# Altium schematic sheet 7_Solenoid.SchDoc
size A
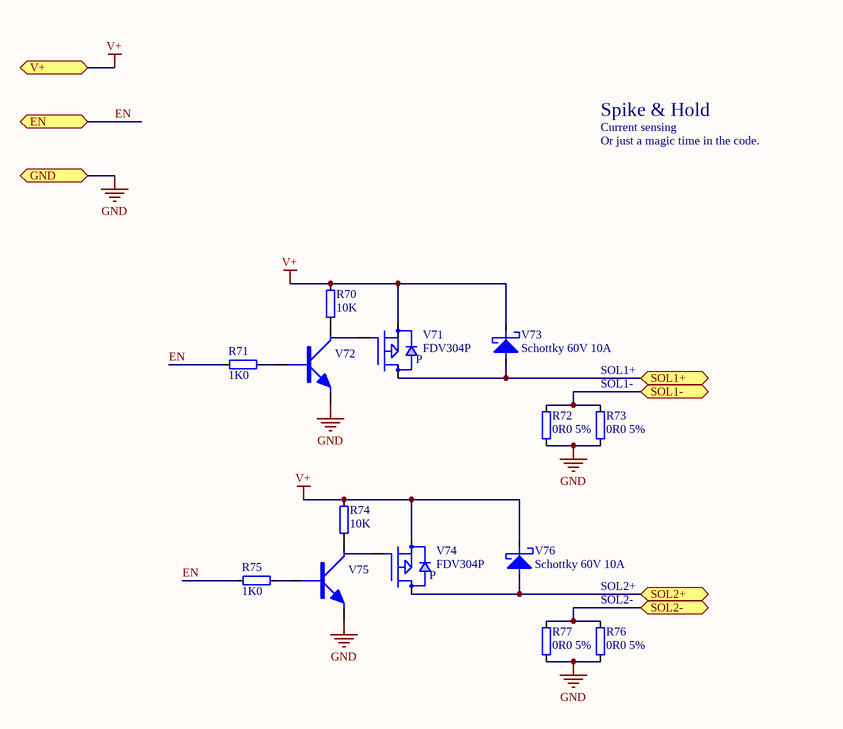
[diagram p0: 7_Solenoid.SchDoc]

## Parts
R70  10K  [1206]
R71  1K0  [0805]
R72  0R0 5%  [1206]
R73  0R0 5%  [1206]
R74  10K  [1206]
R75  1K0  [0805]
R76  0R0 5%  [1206]
R77  0R0 5%  [1206]
V71  FDV304P  [SOT23]
V72  BC846B  [SOT23]  (value not drawn)
V73  Schottky 60V 10A  [DO-214AB-DIODE]
V74  FDV304P  [SOT23]
V75  BC846B  [SOT23]  (value not drawn)
V76  Schottky 60V 10A  [DO-214AB-DIODE]

## Ports
EN, GND, SOL1+, SOL1-, SOL2+, SOL2-, V+

## Nets
GND: R72.1 R73.1 R76.1 R77.1 V72.y(Emitter) V75.y(Emitter) ; port GND
V+: R70.2 R74.2 V71.y(s) V73.k V74.y(s) V76.k ; port V+
EN: R71.1 R75.1 ; port EN
SOL1+: V71.x(d) V73.a ; port SOL1+
SOL1-: R72.2 R73.2 ; port SOL1-
SOL2+: V74.x(d) V76.a ; port SOL2+
SOL2-: R76.2 R77.2 ; port SOL2-
NetR70_1: R70.1 V72.x(Collector)
NetR71_2: R71.2 V72.z(Base)
NetR74_1: R74.1 V75.x(Collector)
NetR75_2: R75.2 V75.z(Base)

Not connected (* = marked no-connect by the designer): V71 z(gate); V74 z(gate)

## Notes on the sheet
- Spike & Hold
- Current sensing
- Or just a magic time in the code.
- (near R73) SOL1+
- (near R73) SOL1-
- (near R76) SOL2+
- (near R76) SOL2-
- (in symbol 5221) P

## Library data of the parts
R70 R74 = 3867: Resistor; Part Field 1: RES 10K 1% 250mW 1206 RoHS; Manufacturer: Phycomp; PartNumber: RC1206FR-0710KL; IPN: 3867; EndOfLife: Active EOL:Jan 2031; Characteristics: 100ppm/C -55..+155C U=150Vrms Reel=5000pcs; OrderNumber: 232272461003L; Lead_Process_Compatible: Yes; SubmittedBy: ART; DeviceRank: 2; Part Field 2: Phycomp RC1206FR-0710KL; ComponentLink1Description: Phycomp_RC1206series_DS.pdf; ComponentLink2Description: Phycomp_Generic_RCS.pdf; ComponentLink1URL: http://ecad.vsl.com.au/apps/BomGen/Data/rel/datasheets/new_parts/Phycomp_RC1206series_DS.pdf; ComponentLink2URL: http://ecad.vsl.com.au/apps/BomGen/Data/rel/rohs_compliance/new_certificates/Phycomp_Generic_RCS.pdf; Altium_Comment_Old: RES 10K 1% 250mW 1206 RoHS; Altium_Comment: 10K; Symbol: RES; Supplier1: Arrow; Supplier1_PartNumber: RC1206FR-0710KL; Supplier2: Xon; IPN_Search: 3867; PartType: PCB; CheckedBy: ART; Price_5000: M$0.004
R71 R75 = 3674: Resistor; Part Field 1: RES 1K0 1% 125mW 0805 RoHS; Manufacturer: Phycomp; PartNumber: RC0805FR-071KL; IPN: 3674; EndOfLife: Active EOL:Jan 2023; Characteristics: 100ppm/C -55..+155C U=150Vrms Reel=5000pcs; OrderNumber: 232273461002L; Lead_Process_Compatible: Yes; SubmittedBy: ART; DeviceRank: 2; Part Field 2: Phycomp RC0805FR-071KL; ComponentLink1Description: Phycomp_RC0805series_DS.pdf; ComponentLink2Description: Phycomp_Generic_RCS.pdf; ComponentLink1URL: http://ecad.vsl.com.au/apps/BomGen/Data/rel/datasheets/new_parts/Phycomp_RC0805series_DS.pdf; ComponentLink2URL: http://ecad.vsl.com.au/apps/BomGen/Data/rel/rohs_compliance/new_certificates/Phycomp_Generic_RCS.pdf; Altium_Comment_Old: RES 1K0 1% 125mW 0805 RoHS; Altium_Comment: 1K0; Symbol: RES; Supplier1: Arrow; Supplier1_PartNumber: RC0805FR-071KL; Supplier2: Xon; IPN_Search: 3674; PartType: PCB; CheckedBy: ART; Price_5000: M$0.003
R72 R73 R76 R77 = 3393: Resistor; Part Field 1: RES 0R0 5% 250mW LINK 1206 RoHS; Manufacturer: Phycomp; PartNumber: RC1206JR-070RL; IPN: 3393; EndOfLife: Active EOL:Jan 2031; Characteristics: 100ppm/C -55..+155C 2A 150Vrms Reel=5000pcs; OrderNumber: 232271191032L; Lead_Process_Compatible: Yes; SubmittedBy: ART; DeviceRank: 2; Part Field 2: Phycomp RC1206JR-070RL; ComponentLink1Description: Phycomp_RC1206series_DS.pdf; ComponentLink2Description: Phycomp_Generic_RCS.pdf; ComponentLink1URL: http://ecad.vsl.com.au/apps/BomGen/Data/rel/datasheets/new_parts/Phycomp_RC1206series_DS.pdf; ComponentLink2URL: http://ecad.vsl.com.au/apps/BomGen/Data/rel/rohs_compliance/new_certificates/Phycomp_Generic_RCS.pdf; Altium_Comment_Old: RES 0R0 5% 250mW LINK 1206 RoHS; Altium_Comment: 0R0 5%; Symbol: RES; Supplier1: Arrow; Supplier1_PartNumber: RC1206JR-070RL; Supplier2: Xon; IPN_Search: 3393; PartType: PCB; CheckedBy: ART; Price_5000: M$0.003
V71 V74 = 5221: MOSFET P CHANNEL GENERIC SOT23; Part Field 1: MOSFET P-CH FDV304P SOT23; Manufacturer: Fairchild; IPN: 5221; EndOfLife: Active EOL:Jul 2022; Characteristics: 25V 0.46A 1.5R Vgs=1.5V 150deg; Lead_Process_Compatible: Yes; SubmittedBy: KZB; DeviceRank: 2; Part Field 2: Fairchild FDV304P; ComponentLink1Description: Fairchild_FDV304P_DS.pdf; ComponentLink2Description: Fairchild_Generic_RCS.pdf; ComponentLink1URL: http://ecad.vsl.com.au/apps/BomGen/Data/rel/datasheets/new_parts/Fairchild_FDV304P_DS.pdf; ComponentLink2URL: http://ecad.vsl.com.au/apps/BomGen/Data/rel/rohs_compliance/new_certificates/Fairchild_Generic_RCS.pdf; Altium_Comment_Old: MOSFET P-CH FDV304P SOT23; Altium_Comment: FDV304P; Symbol: MOSFET-P-SOT23; PartNumber: FDV304P; LastChanged: 10/06/10 13:58:43; Supplier1: Digikey; Supplier1_PartNumber: FDV304PCT-ND; Supplier2: Farnell; Supplier2_PartNumber: 9846123; IPN_Search: 5221; OrderNumber: FDV304P; PartType: PCB; Price: 0.697; CheckedBy: AJR; Price_100: M$0.102; Price_1000: M$0.070; Price_5000: M$0.053
V72 V75 = 3412: NPN Transistor SOT23; Part Field 1: BJT NPN BC846 SOT23 RoHS; Manufacturer: NXP; IPN: 3412; EndOfLife: Active EOL:Nov 2023; Characteristics: Ic=100mA Vceo=65V Pt=250mW Tj=150degC Hfe=200..450; OrderNumber: 9335 895 60215; Lead_Process_Compatible: Yes; SubmittedBy: ART; DeviceRank: 1; Part Field 2: NXP BC846B; ComponentLink1Description: NXP_BC84xseries_DS.pdf; ComponentLink2Description: NXP_BC846B_MD.xls; ComponentLink1URL: http://ecad.vsl.com.au/apps/BomGen/Data/rel/datasheets/new_parts/NXP_BC84xseries_DS.pdf; ComponentLink2URL: Not Found; Altium_Comment_Old: BJT NPN BC846 SOT23 RoHS; Altium_Comment: BC846B; Symbol: NPN-SOT23; PartNumber: BC846B; LastChanged: 24/08/09 11:56:43; Supplier1: Mouser; Supplier1_PartNumber: 771-BC846B-T/R; Supplier2: Digikey; Supplier2_PartNumber: 568-1632-1-ND; IPN_Search: 3412; PartType: PCB; CheckedBy: LZZ; Price_100: M$0.040; Price_1000: M$0.027; Price_5000: M$0.020
V73 V76 = 9925: DIODE SCHOTTKY GENERIC; Part Field 1: DIODE SCHOTTKY 60V 10A SMD RoHS; Manufacturer: Micro Commercial Co; PartNumber: SK106-TP; IPN: 9925; Characteristics: Vrmax=60V Ifmax=10A Vf=0.85V -55..+125; Lead_Process_Compatible: Yes; SubmittedBy: zmze; DeviceRank: 2; Part Field 2: Micro Commercial Co SK106-TP; ComponentLink1Description: Micro Commercial Co_SK106-TP_SK102-SK1010(HSMC).PDF; ComponentLink2Description: Compliant; ComponentLink1URL: http://ecad.vsl.com.au/apps/BomGen/Data/rel/datasheets/Micro Commercial Co/Micro Commercial Co_SK106-TP_SK102-SK1010(HSMC).PDF; Altium_Comment_Old: DIODE SCHOTTKY 60V 10A SMD RoHS; Altium_Comment: Schottky 60V 10A; Symbol: SCHOTTKY; LastChanged: 26/08/16 14:34:18; Supplier1: Digikey; Supplier1_PartNumber: SK106-TPCT-ND; IPN_Search: 9925; OrderNumber: SK106-TP; PartType: PCB